# EAGLE design picoavr (EAGLE 6.5.0)
AVR Board Rev 1.0 USBasp compatible
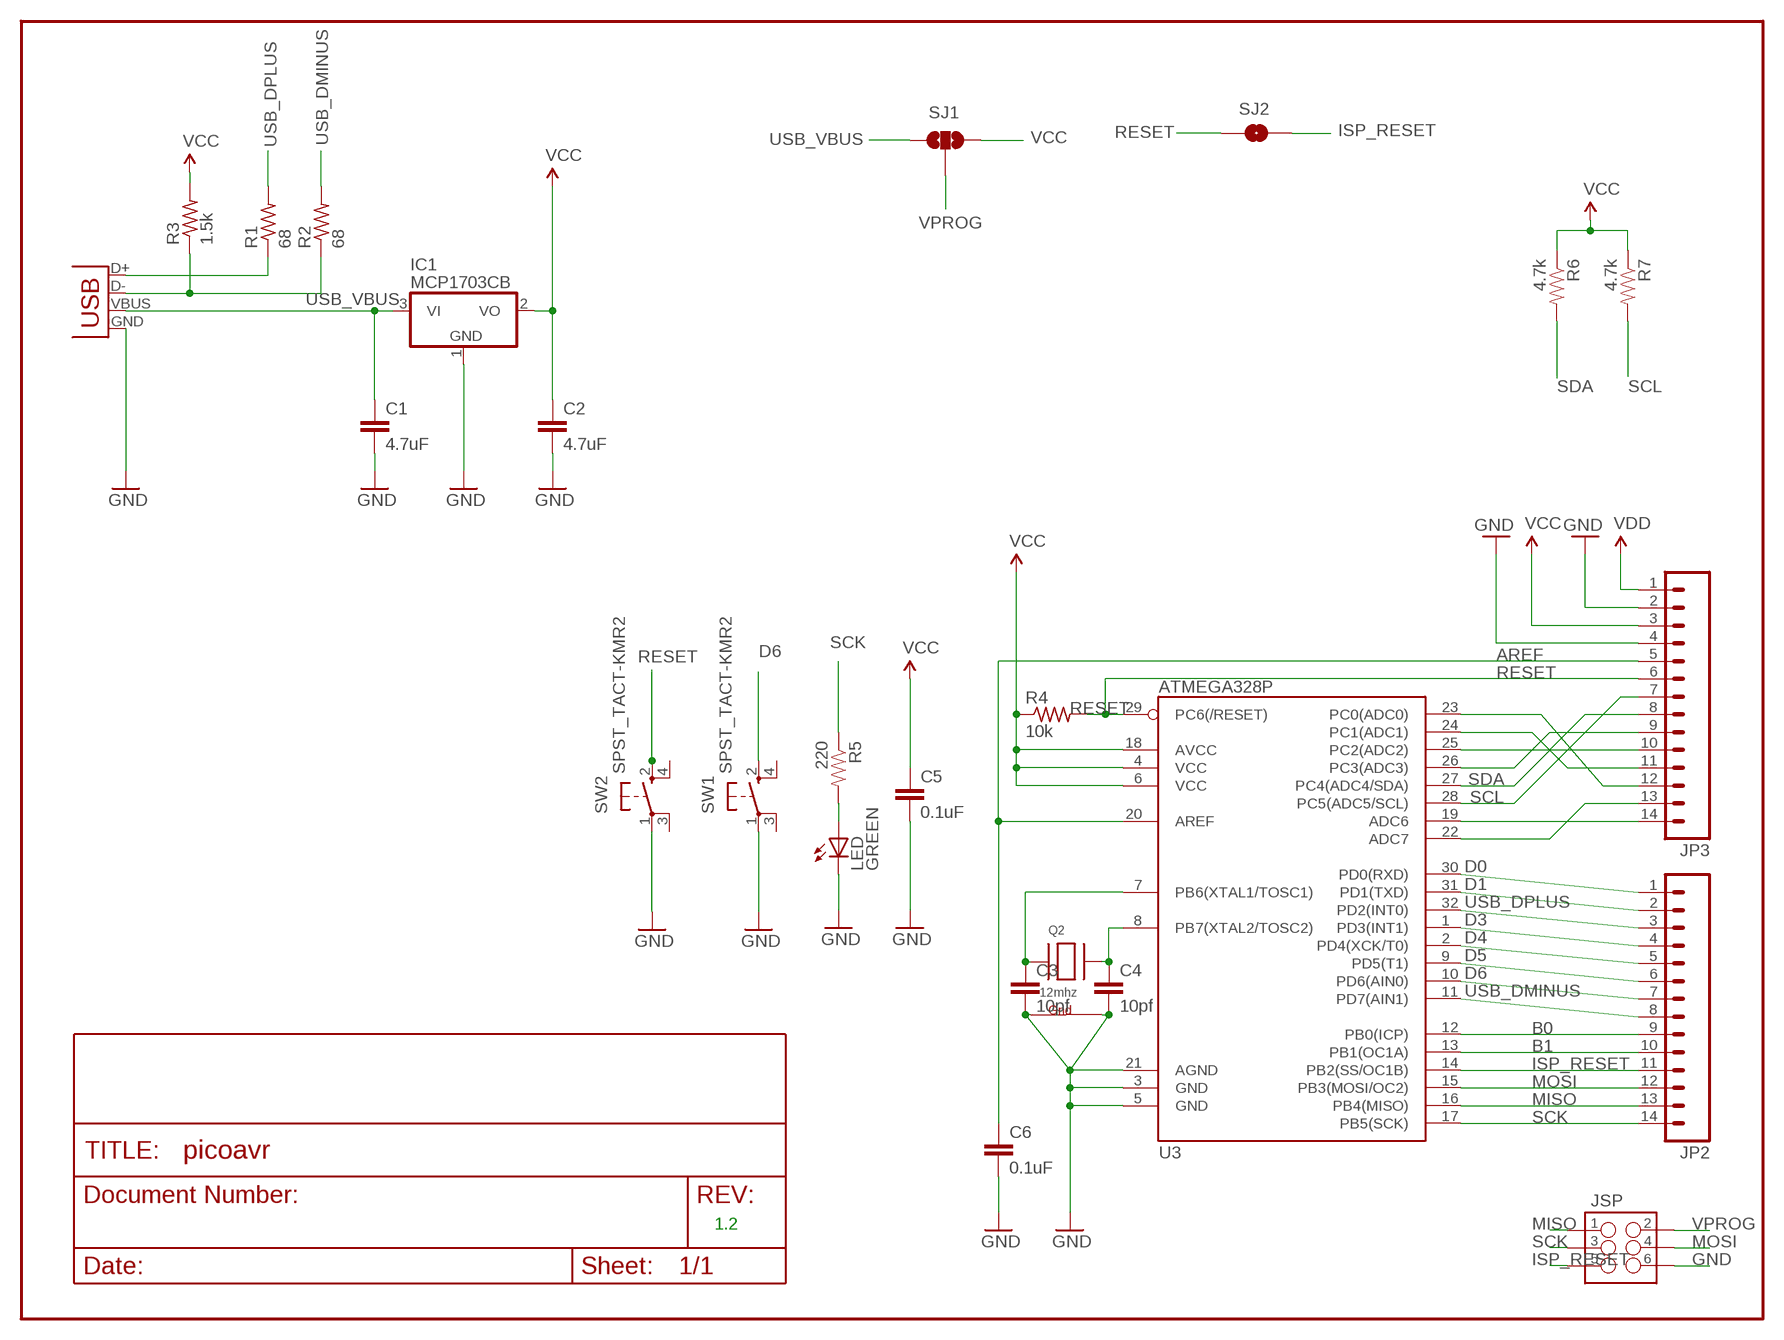
[diagram p0: schematic, sheet 1]

## Parts
C1  4.7uF  CAP0402-CAP  [0402-CAP]
C2  4.7uF  CAP0402-CAP  [0402-CAP]
C3  10pf  CAP0402-CAP  [0402-CAP]
C4  10pf  CAP0402-CAP  [0402-CAP]
C5  0.1uF  CAP0402-CAP  [0402-CAP]
C6  0.1uF  CAP0402-CAP  [0402-CAP]
IC1  MCP1703CB  [SOT23]
JP2  M14LOCK  [1X14_LOCK]
JP3  M14LOCK  [1X14_LOCK]
JSP  ICSP  M03X2NO_SILK  [2X3-NS]
LED  GREEN  LED0603  [LED-0603]
Q2  12mhz  XTAL-4-3225  [NX3225]
R1  68  R-US_R0402  [R0402]
R2  68  R-US_R0402  [R0402]
R3  1.5k  R-US_R0402  [R0402]
R4  10k  R-US_R0402  [R0402]
R5  220  RESISTOR0402-RES  [0402-RES]
R6  4.7k  RESISTOR0402-RES  [0402-RES]
R7  4.7k  RESISTOR0402-RES  [0402-RES]
SJ1  SJ1  SOLDERJUMPER_2WAYS  [SJ_3]
SJ2  SOLDERJUMPERNO  [SJ_2S-NO]
SW1  SPST_TACT-KMR2  [KMR2]
SW2  SPST_TACT-KMR2  [KMR2]
U3  ATMEGA328P  ATMEGA328_SMT  [TQFP32-08]
X1  Micro USB  USB-MICROB  [USB-MICROB]

## Nets
A0: JP3.12 U3.23(PC0(ADC0))
A1: JP3.11 U3.24(PC1(ADC1))
A2: JP3.10 U3.25(PC2(ADC2))
A3: JP3.9 U3.26(PC3(ADC3))
A6: JP3.14 U3.19(ADC6)
A7: JP3.13 U3.22(ADC7)
AREF: C6.1 JP3.5 U3.20(AREF)
B0: JP2.9 U3.12(PB0(ICP))
B1: JP2.10 U3.13(PB1(OC1A))
D0: JP2.1 U3.30(PD0(RXD))
D1: JP2.2 U3.31(PD1(TXD))
D3: JP2.4 U3.1(PD3(INT1))
D4: JP2.5 U3.2(PD4(XCK/T0))
D5: JP2.6 U3.9(PD5(T1))
D6: JP2.7 SW1.2(S) U3.10(PD6(AIN0))
GND: C1.2 C2.2 C3.2 C4.2 C5.2 C6.2 IC1.1(GND) JP3.2 JP3.4 JSP.6 LED.C Q2.2(G2) Q2.4(G1) SW1.1(P) SW2.1(P) U3.3(GND) U3.5(GND) U3.21(AGND) X1.GND
ISP_RESET: JP2.11 JSP.5 SJ2.2 U3.14(PB2(SS/OC1B))
MISO: JP2.13 JSP.1 U3.16(PB4(MISO))
MOSI: JP2.12 JSP.4 U3.15(PB3(MOSI/OC2))
N$2: R1.1 X1.D+
N$4: R2.1 R3.1 X1.D-
N$5: C4.1 Q2.3(X2) U3.8(PB7(XTAL2/TOSC2))
N$6: C3.1 Q2.1(X1) U3.7(PB6(XTAL1/TOSC1))
N$11: LED.A R5.2
RESET: JP3.6 R4.2 SJ2.1 SW2.2(S) U3.29(PC6(/RESET))
SCK: JP2.14 JSP.3 R5.1 U3.17(PB5(SCK))
SCL: JP3.7 R7.2 U3.28(PC5(ADC5/SCL))
SDA: JP3.8 R6.2 U3.27(PC4(ADC4/SDA))
USB_DMINUS: JP2.8 R2.2 U3.11(PD7(AIN1))
USB_DPLUS: JP2.3 R1.2 U3.32(PD2(INT0))
USB_VBUS: C1.1 IC1.3(VI) JP3.1 SJ1.1 X1.VBUS ; supply symbol labelled VDD
VCC: C2.1 C5.1 IC1.2(VO) JP3.3 R3.2 R4.1 R6.1 R7.1 SJ1.3 U3.4(VCC) U3.6(VCC) U3.18(AVCC)
VPROG: JSP.2 SJ1.2
Unconnected: SW1.3(P1) SW1.4(S1) SW2.3(P1) SW2.4(S1)

## Notes on the sheet
- 1.2

## Library data of the parts
C1 C2 = SparkFun:CAP: Capacitor Standard 0603 ceramic capacitor, and 0.1" leaded capacitor.
C3-C6 = SparkFun-Capacitors:CAP: Capacitor Standard 0603 ceramic capacitor, and 0.1" leaded capacitor.
IC1 = linear:MCP1703: 250 mA, 16V, Low Quiescent Current LDO Regulator Source: http://ww1.microchip.com/downloads/en/DeviceDoc/22049b.pdf
JP2 JP3 = SparkFun-Connectors:M14: Header 14 Standard 14-pin 0.1" header. Use with straight break away headers (SKU : PRT-00116), right angle break away headers (PRT-00553), swiss pins (PRT-00743), machine pins (PRT-00117), and female headers (PRT-00115).
JSP = SparkFun-Connectors:M03X2: 2x3 .1" header. Shrouded, with keying- CONN-10681 SMT- CONN-11415 Pogo pins- HW-11044
LED = SparkFun:LED: LEDs Standard schematic elements and footprints for 5mm, 3mm, 1206, and 0603 sized LEDs. 5mm - Spark Fun Electronics SKU : COM-00529 (and others)
Q2 = adafruit:XTAL-4: Classic 4-pin 3.2 x 2.5mm crystal
R1-R4 = resistor:R-US_: RESISTOR, American symbol
R5-R7 = SparkFun:RESISTOR: Resistor Basic schematic elements and footprints for 0603, 1206, and PTH resistors.
SJ1 = SparkFun-Passives:SOLDERJUMPER_2WAY: Solder Jumper 2 way solder jumper
SJ2 = SparkFun-Passives:SOLDERJUMPER: Solder Jumper Standard SMD solder jumper. Used to automate production. Two varients : Normally Open and Normally Closed are the same, but have different paste layers. NC will have a large amount of paste and should jumper during reflow.
SW1 SW2 = adafruit:SPST_TACT: SMT 6mm switch, EVQQ2 series http://www.ladyada.net/library/eagle
U3 = SparkFun-DigitalIC:ATMEGA328_SMT: 32-Pin Atmega328 part Commonly used on Arduino compatible boards Available in QFP and QFN packages TQFP is IC-09069 QFN is non-stock; PROD_ID: IC-09069
X1 = SparkFun:USB: USB Connectors USB-B-PTH is fully proven SKU : PRT-00139 USB-miniB is fully proven SKU : PRT-00587 USB-A-PCB is untested. USB-A-H is throughly reviewed, but untested. Spark Fun Electronics SKU : PRT-00437 USB-B-SMT is throughly reviewed, but untested. Needs silkscreen touching up. USB-A-S has not been used/tested USB-MB-H has not been used/tested

## Board
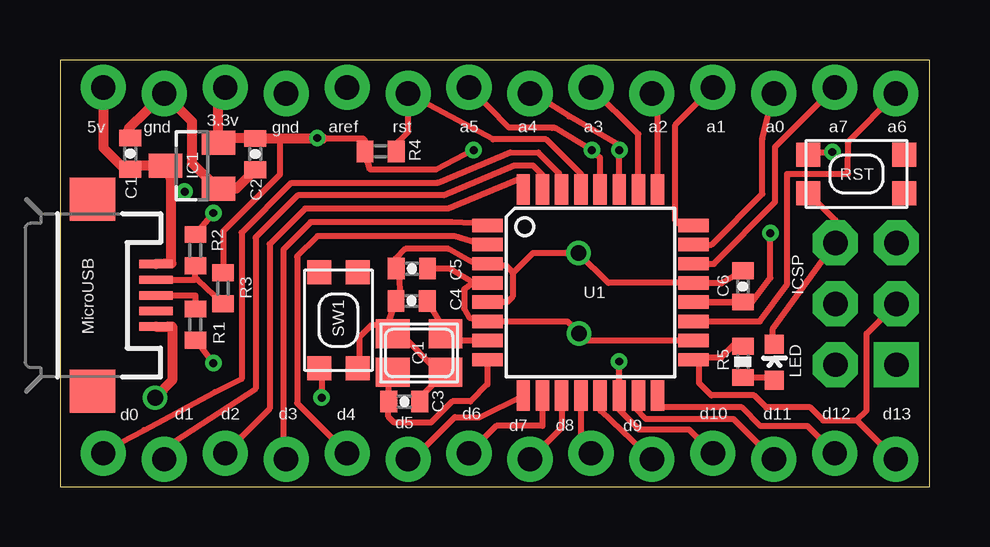
[diagram p1: board, top side]
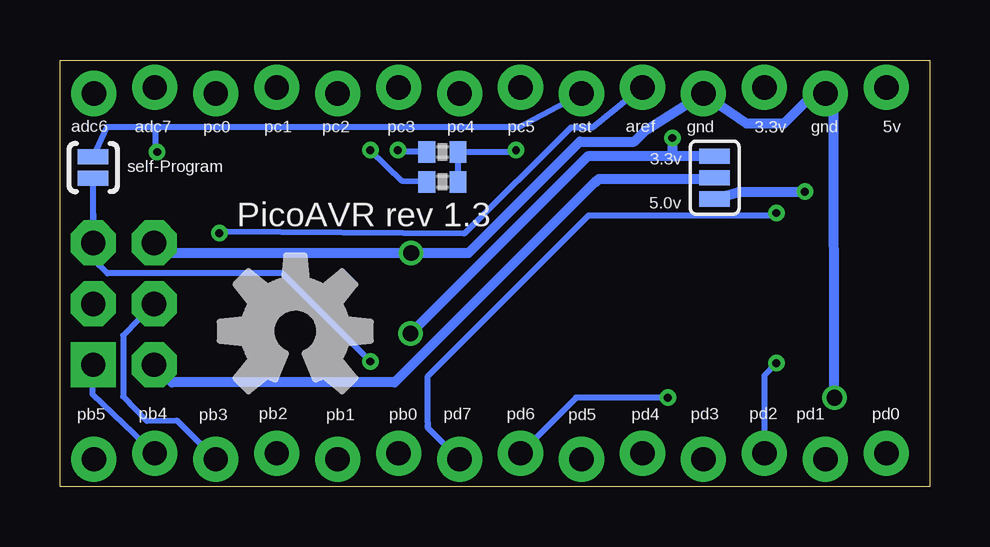
[diagram p2: board, bottom side, seen from below]

Size 36.23 x 17.78 mm. Coordinates in mm from the lower left corner, seen from the top.
Outline: 0,0 36.23,0 36.23,17.78 0,17.77 0,0
Copper layers (1*16): Top 0.0356mm / dielectric 1.5011mm / Bottom 0.0356mm
Design rules "LaenPCBOrder": minimum track width 6mil, minimum drill 13mil, track to track 6mil, track to pad 6mil, pad to pad 6mil, via to via 6mil, smd to smd 6mil, copper to edge 15mil, drill to drill 6mil, minimum pad ring 7mil, minimum via ring 7mil, stop-mask expansion 3mil, vias tented up to drill 0mil, thermal gap 10mil

### Footprints (pad centres in the part's own frame; a part is rotated, then mirrored left to right if it is on the bottom)
0402-CAP = smd 0.7 x 0.9: 1 -0.65,0; 2 0.65,0
SOT23 = smd 1 x 1.4: 1 -0.95,-1.1; 2 0.95,-1.1; 3 0,1.1
1X14_LOCK = drill 1.016 pad 1.88: 1 0,0.127; 2 2.54,-0.127; 3 5.08,0.127; 4 7.62,-0.127; 5 10.16,0.127; 6 12.7,-0.127; 7 15.24,0.127; 8 17.78,-0.127; 9 20.32,0.127; 10 22.86,-0.127; 11 25.4,0.127; 12 27.94,-0.127; 13 30.48,0.127; 14 33.02,-0.127
2X3-NS = drill 1.016 pad 1.88 square: 1 -2.54,-1.27 | drill 1.016 pad 1.88 octagon: 2 -2.54,1.27; 3 0,-1.27; 4 0,1.27; 5 2.54,-1.27; 6 2.54,1.27
LED-0603 = smd 0.8 x 0.8: A 0,-0.75; C 0,0.75
NX3225 = smd 1.4 x 1.2: 1 -1.1,-0.8; 2 1.1,-0.8; 3 1.1,0.8; 4 -1.1,0.8
R0402 = smd 0.7 x 0.9: 1 -0.65,0; 2 0.65,0
0402-RES = smd 0.7 x 0.9: 1 -0.65,0; 2 0.65,0
SJ_3 = smd 0.635 x 1.27: 1 -0.889,0; 2 0,0; 3 0.889,0
SJ_2S-NO = smd 0.635 x 1.27: 1 -0.45,0; 2 0.45,0
KMR2 = smd 1 x 1: 1 2,0.8; 2 2,-0.8; 3 -2,0.8; 4 -2,-0.8
TQFP32-08 = smd 1.27 x 0.559: 1 -4.293,2.8; 2 -4.293,2; 3 -4.293,1.2; 4 -4.293,0.4; 5 -4.293,-0.4; 6 -4.293,-1.2; 7 -4.293,-2; 8 -4.293,-2.8; 17 4.293,-2.8; 18 4.293,-2; 19 4.293,-1.2; 20 4.293,-0.4; 21 4.293,0.4; 22 4.293,1.2; 23 4.293,2; 24 4.293,2.8 | smd 0.559 x 1.27: 9 -2.8,-4.293; 10 -2,-4.293; 11 -1.2,-4.293; 12 -0.4,-4.293; 13 0.4,-4.293; 14 1.2,-4.293; 15 2,-4.293; 16 2.8,-4.293; 25 2.8,4.293; 26 2,4.293; 27 1.2,4.293; 28 0.4,4.293; 29 -0.4,4.293; 30 -1.2,4.293; 31 -2,4.293; 32 -2.8,4.293
USB-MICROB = smd 0.35 x 1.4: D+ 0,2.65; D- -0.65,2.65; GND 1.3,2.65; ID 0.65,2.65; VBUS -1.3,2.65 | smd 1.8 x 1.9: MT1 -4,0; MT2 4,0

### Placement (x,y rotation side)
C1  2.93,13.88 90 top
C2  8.14,13.86 270 top
C3  14.65,7.74 180 top
C4  14.35,3.54 0 top
C5  14.66,9.09 180 top
C6  28.45,8.34 90 top
IC1  5.5,13.37 90 top
JP2  1.8,1.27 0 top
JP3  1.8,16.51 0 top
JSP  33.58,7.62 90 top
LED  29.76,5.18 0 top
Q2  14.96,5.57 180 top
R1  5.64,6.76 270 top
R2  5.64,9.86 90 top
R3  6.79,8.27 90 top
R4  13.36,13.97 0 top
R5  28.45,5.2 270 top
R6  20.3,12.7 180 bottom
R7  20.3,13.95 180 bottom
SJ1  8.95,12.88 90 bottom
SJ2  34.85,13.3 270 bottom
SW1  11.6,6.94 270 top
SW2  33.19,13.03 180 top
U3  22.1,8.09 0 top
X1  1.35,7.98 270 top

### Tracks (layer width: path | path; a pad name or v marks a point on that pad's centre or on a via)
A0
  Top 0.254: U3.23 27.15,10.09 29.27,12.2 29.27,14.49 JP3.12
A1
  Top 0.254: U3.24 26.05,10.89 25.95,11 25.72,11 25.64,11.07 25.64,15.08 JP3.11
A2
  Top 0.254: U3.25 24.9,15.41 JP3.10
A3
  Top 0.254: U3.26 24.1,14.69 JP3.9
A6
  Top 0.254: U3.19 29.16,6.89 30.3,8.44 30.3,13.04 32.83,13.03 32.84,14.38 JP3.14
A7
  Top 0.254: U3.22 27.24,9.29 29.8,11.87 29.8,14.16 JP3.13
AREF  (via drill 0.33)
  Top 0.254: C6.1 28.83,7.69 U3.20 26.17,7.71 28.83,7.71 29.6,8.7 v29.6,10.57
  Bottom 0.254: JP3.5 14.05,14.96 14.95,14.96 19.39,10.54 29.58,10.62 29.6,10.6 v29.6,10.57
B0
  Top 0.254: U3.12 21.7,1.82 JP2.9
B1
  Top 0.254: U3.13 22.52,3.16 JP2.10
D0
  Top 0.254: JP2.1 2.08,1.6 3.5,2.36 6.45,3.94 7.57,4.5 7.57,10.59 9.64,12.66 9.66,12.66 15.73,12.67 18.76,13.93 19.93,13.92 20.78,13.07 20.83,12.45 U3.30
D1
  Top 0.254: JP2.2 4.37,1.63 8.15,4.09 8.15,10.36 8.14,10.38 9.91,12.14 15.98,12.15 18.92,13.39 19.7,13.39 20.1,12.99 U3.31 20.07,12.41
D3
  Top 0.254: U3.1 17.68,10.76 17.68,10.96 16.33,11.02 10.44,11.02 10.44,11.01 9.32,9.89 9.32,1.17 JP2.4
D4
  Top 0.254: U3.2 17.61,10.09 16.44,10.44 10.73,10.44 9.87,9.58 9.88,9.56 9.88,3.48 JP2.5
D5
  Top 0.254: JP2.6 14.7,1.14 16.45,2.9 17.5,2.9 U3.9
D6  (via drill 0.33)
  Top 0.254: U3.10 20.1,2.53 18.19,2.54 JP2.7 | SW1.2 10.9,4.8 v10.9,3.71
  Bottom 0.254: v10.9,3.71 14.73,3.71 JP2.7
GND  (via drill 0.66)
  Top 0.254: C6.2 28.47,8.99 27.56,8.47 26.41,8.47 U3.21 | 18.04,7.71 U3.5 18.63,7.7 18.86,7.92 18.86,8.89 | 26.17,8.47 U3.21 | LED.C 29.7,5.71 29.7,6.58 JSP.6 32.31,11.11 SW2.1 | Q2.2 14.28,6.28 15.69,4.88 15.85,4.75 Q2.4 | 16.04,4.93 Q2.4 | Q2.2 14.05,6.74 12.99,6.74 12.5,6.25 12.5,4.8 SW1.1 | Q2.2 13.59,6.65 C3.2 14.18,7.86 14.16,8.87 14.02,8.97 C5.2 13.99,9.51 14.39,9.91 16.19,9.91 17.11,9.4 17.7,9.4 U3.3 18.04,9.23 18.57,9.23 18.86,8.94 18.86,8.89 | C4.2 15,3.71 Q2.4 | U3.21 22.85,8.49 v21.6,9.74 19.71,9.74 18.86,8.89
  Top 0.406: C1.2 2.87,14.94 JP3.2 5.49,15.22 5.49,13.49 IC1.1 7.35,12.42 C2.2 | X1.GND 4.49,6.68 4.5,6.68 4.67,6.68 4.67,4.43 v3.96,3.71
  Bottom 0.152: v21.6,9.74 21.81,9.91 21.81,9.73
  Bottom 0.406: v3.96,3.71 3.99,16.25 4.24,16.5 JP3.2 4.8,16.4 6.06,15.14 7.64,15.14 JP3.4 9.4,16.36 11.85,14.83 12.31,14.38 14.57,14.38 19.21,9.73 21.81,9.73 31.88,9.73 JSP.6
ISP_RESET  (via drill 0.33)
  Top 0.254: v23.3,5.22 23.3,3.9 U3.14 23.3,3.21 24.12,2.39 26.21,2.39 JP2.11
  Bottom 0.254: JSP.5 34.85,11.81 SJ2.2 | 34.85,11.37 JSP.5 | v23.3,5.22 26.97,8.89 34.25,8.89 34.85,9.49 JSP.5
MISO
  Top 0.254: U3.16 24.9,3.38 24.9,3.64 25.06,3.3 28.41,3.3 29.18,2.53 31.15,2.53 JP2.13
  Bottom 0.254: JP2.13 34.87,3.86 JSP.1
MOSI
  Top 0.254: U3.15 23.98,3.29 24.41,2.83 28.06,2.83 JP2.12
  Bottom 0.254: JSP.4 33.6,6.3 33.6,3.76 32.61,2.74 31.37,2.77 JP2.12
N$2
  Top 0.254: X1.D+ 5.64,7.98 R1.1
N$4
  Top 0.254: X1.D- 5.64,8.63 | 5.64,8.63 R2.1 | R3.1 5.74,8.63 5.64,8.63
N$5
  Top 0.254: 14.08,5.14 Q2.3 13.7,4.61 C4.1 13.68,3.52 13.68,2.92 13.93,2.67 15.46,2.67 16.34,3.56 17.11,3.56 17.81,4.26 U3.8
N$6
  Top 0.254: C3.1 16.01,6.58 16.26,6.51 16.11,6.66 Q2.1 16.35,6.09 U3.7
N$11
  Top 0.254: 29.72,4.3 LED.A 29.76,4.55 R5.2
RESET  (via drill 0.33)
  Top 0.254: U3.29 21.7,13.04 20.25,14.48 18.05,14.48 JP3.6 14.5,14.77 13.83,14.1 R4.2 | SW2.2 31.18,13.94 32.16,13.94 v32.18,13.95
  Bottom 0.254: JP3.6 17.11,14.98 32.23,14.98 | 32.23,14.98 34.28,14.98 SJ2.1 | v32.18,13.95 32.24,13.95 32.23,14.98
SCK
  Top 0.254: 33.2,2.77 31.8,2.77 31.27,3.3 29.43,3.3 28.92,3.81 27.14,3.81 26.63,4.32 26.63,5.05 U3.17 26.87,5.39 27.56,5.39 28.24,6.07 R5.1 | 33.2,2.77 JP2.14 | JSP.3 33.6,6.38 33.6,3.17 33.2,2.77
SCL  (via drill 0.33)
  Top 0.254: U3.28 22.5,13.71 v22.16,14.02 20.62,14.96 20.5,14.95 18.71,14.96 JP3.7
  Bottom 0.254: R7.2 22.05,13.95 v22.16,14.02
SDA  (via drill 0.33)
  Top 0.152: 19.83,16.34 19.77,16.26 JP3.8
  Top 0.254: U3.27 23.3,14.23 | 23.3,14.23 21.21,15.43 20.42,15.94 19.83,16.34 19.65,16.46 | v23.3,14.02 23.27,14.2 23.3,14.23
  Bottom 0.254: R6.2 21.96,12.73 v23.3,14.02
USB_DMINUS  (via drill 0.33)
  Top 0.254: JP2.8 20.92,2.48 20.92,3.78 U3.11 | R2.2 v6.39,11.4
  Bottom 0.254: JP2.8 20.92,2.48 20.92,2.49 | 20.92,2.49 20.92,2.54 20.9,2.55 20.9,2.48 20.92,2.49 | v6.39,11.4 6.58,11.4 6.55,11.37 | 20.92,2.49 20.9,2.66 20.9,4.61 14.21,11.3 6.49,11.3 v6.39,11.4 | 6.41,11.43 v6.39,11.4
USB_DPLUS  (via drill 0.33)
  Top 0.254: U3.32 19.14,12.83 16.18,11.6 10.21,11.6 10.21,11.58 8.74,10.11 8.74,3.25 JP2.3 | 6.38,5.14 v6.39,5.15 5.81,5.9 R1.2
  Bottom 0.254: v6.39,5.15 6.88,4.63 JP2.3
USB_VBUS  (via drill 0.33)
  Top 0.406: JP3.1 1.8,14.12 2.76,13.18 2.85,13.19 C1.1 3.04,13.37 IC1.3 4.61,13.3 4.64,12.32 | X1.VBUS 4.64,9.31 4.64,12.32 | v5.19,12.29 5.17,12.32 4.64,12.32
  Bottom 0.406: SJ1.1 7.91,12.29 v5.19,12.29
VCC  (via drill 0.33, 0.66)
  Top 0.152: 9.11,14.51 9.11,14.22 9.17,14.22 | 10.63,14.51 10.63,14.48 v10.72,14.53 10.88,14.48 10.88,14.51
  Top 0.254: U3.4 17.22,8.49 | 17.22,8.49 16.83,8.22 16.83,7.42 17.06,7.05 U3.6 21.14,6.89 v21.63,6.39 21.94,6.09 U3.18 | R3.2 6.79,10.64 9.17,13.03 9.17,14.22 9.17,14.3 | v17.23,14.02 17.25,14.04 15.66,13.21 12.93,13.21 12.52,14.51 12.67,14.33 R4.1 12.71,14.42 12.63,14.51 11.09,14.51 10.88,14.51 10.81,14.5 | 17.22,8.49 16.24,9.07 C5.1
  Top 0.406: JP3.3 6.6,16.13 IC1.2 6.56,14.52 C2.1 9.11,14.51 10.63,14.51 10.95,14.51
  Bottom 0.254: R6.1 R7.1 17.23,13.95 v17.23,14.02
  Bottom 0.406: SJ1.3 10.63,13.77 | 10.63,13.77 14.25,13.77 v21.63,6.39 | v10.72,14.53 10.72,13.86 10.63,13.77
VPROG
  Bottom 0.406: SJ1.2 9,12.83 13.78,12.83 13.91,12.7 13.93,12.7 22.29,4.34 31.57,4.34 JSP.2

### Text on the board
_tsilk: 5v | gnd | 3.3v | gnd | aref | rst | a5 | a4 | a3 | a2 | a1 | a0 | a7 | a6 | R4 | IC1 | RST | C1 | C2 | R2 | C5 | R3 | C4 | U1 | C6 | ICSP | SW1 | MicroUSB | R1 | Q1 | R5 | LED | C3 | d0 | d1 | d2 | d3 | d4 | d6 | d10 | d11 | d12 | d13 | d5 | d7 | d8 | d9
_bsilk: 5v | gnd | 3.3v | gnd | aref | rst | pc5 | pc4 | pc3 | pc2 | pc1 | pc0 | adc7 | adc6 | 3.3v | self-Program | 5.0v | PicoAVR rev 1.3 | pd0 | pd1 | pd2 | pd3 | pd4 | pd5 | pd6 | pd7 | pb0 | pb1 | pb2 | pb3 | pb4 | pb5